# EAGLE design piezo-preamp-tickler_V3-4_single-supply-OPA164_INPROGRESS2 (EAGLE 8.5.0)

## Sheet 1 of 2
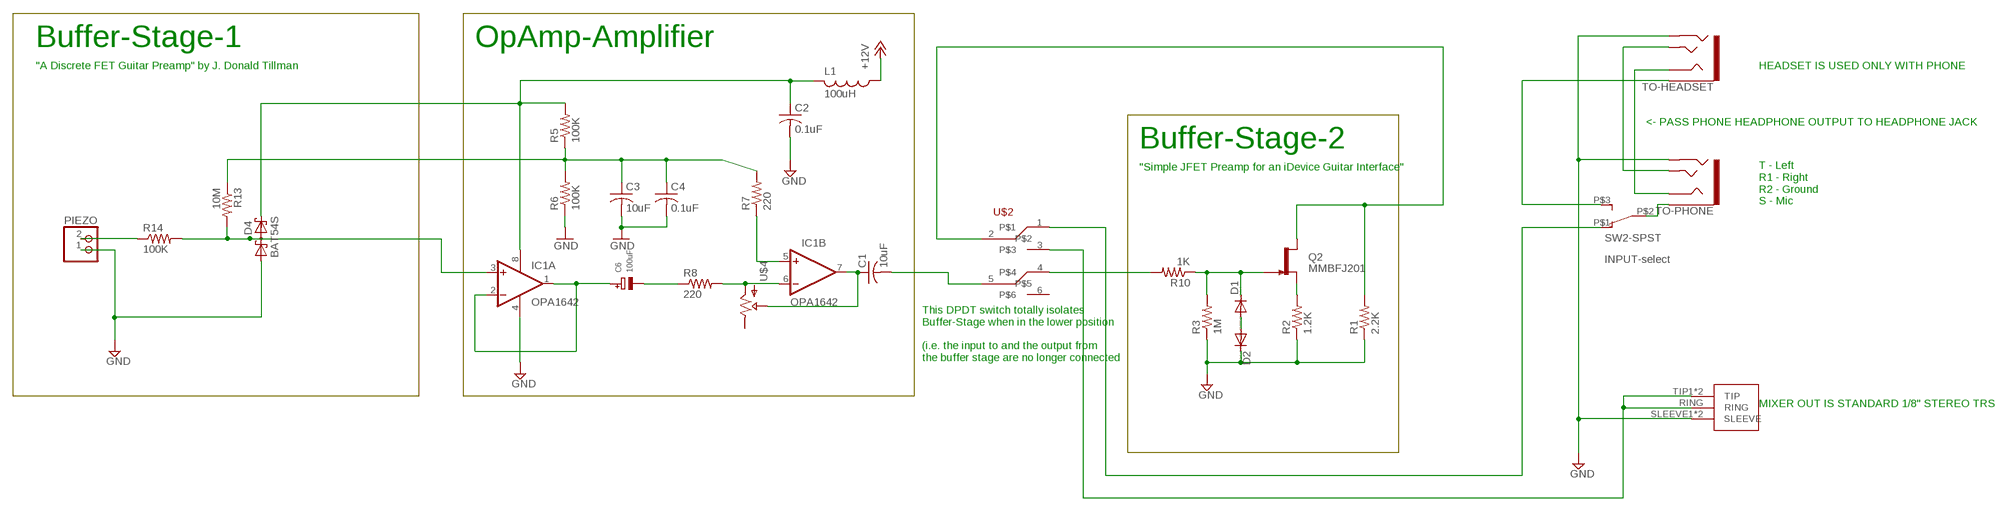
[diagram p0: schematic, sheet 1]

### Parts
C1  10uF  C-USC0603  [C0603]
C2  0.1uF  C-USC0805K  [C0805K]
C3  10uF  C-USC0805K  [C0805K]
C4  0.1uF  C-USC0805K  [C0805K]
C6  100uF  CAP_TANTALUMA/3216_REFLOW  [EIA3216-18/A-R]
D1  DIODE-SOD123  [SOD123]
D2  DIODE-SOD123  [SOD123]
D4  BAT54S  [SOT23]
IC1  OPA1642  OPA2134UA  [SO08]
J2  1/8"-F-STEREO-PCB  [1/8"-F-STEREO-PCB]
L1  100uH  L-USL3225P  [L3225P]
PIEZO  JST_2PIN-THM  [JST-PH-2-THM]
Q2  MMBFJ201  J201SOT-23  [SOT23-3]
R1  2.2K  R-US_R0603  [R0603]
R2  1.2K  R-US_R0603  [R0603]
R3  1M  R-US_R0603  [R0603]
R5  100K  R-US_R0603  [R0603]
R6  100K  R-US_R0603  [R0603]
R7  220  R-US_R0603  [R0603]
R8  220  R-US_R0603  [R0603]
R10  1K  R-US_R0603  [R0603]
R13  10M  R-US_R0603  [R0603]
R14  100K  R-US_R0603  [R0603]
SW2-SPST  INPUT-select  SWITCH_SPDTCL-SB-12B  [SWITCH_SPDT_CL-SB-12B]
TO-HEADSET  AUDIO-JACK3LGPADS  [AUDIO-JACK-TRRS-SMD]
TO-PHONE  AUDIO-JACK3LGPADS  [AUDIO-JACK-TRRS-SMD]
U$2  SWITCH_DPDT  [SWITCH_DPDT_CL-SB-22B]
U$4  POTPOT-THUMB-ALPHA  [POT-THUMB-14MM_ALPHA-RV100F-30-4K1B-B10K-B301]

### Nets
+12V: L1.1 ; also sheet 2
GND: C2.2 C3.2 C4.2 D2.C D4.1(A1) IC1.4(A:V-) J2.SLEEVE1(SLEEVE) J2.SLEEVE2(SLEEVE) PIEZO.1 R1.1 R2.1 R3.1 R6.1 TO-HEADSET.RING2 TO-PHONE.RING2 ; also sheet 2
N$1: D1.A D2.A
N$2: PIEZO.2 R14.1
N$3: Q2.2(S) R2.2
N$4: TO-HEADSET.EARTH
N$5: IC1.5(B:+IN) R7.1
N$6: C1.1 IC1.7(B:OUT) U$4.P$3(WIPER)
N$7: IC1.6(B:-IN) R8.2 U$4.P$1(IN)
N$9: D4.3(C1A2) IC1.3(A:+IN) R13.2 R14.2
N$10: D1.C Q2.3(G) R3.2 R10.1
N$11: R10.2 U$2.4
N$12: J2.RING J2.TIP1(TIP) J2.TIP2(TIP) U$2.3
N$13: TO-HEADSET.TIP TO-PHONE.TIP
N$14: C6.- R8.1
N$15: TO-HEADSET.RING1 TO-PHONE.RING1
N$16: C1.2 U$2.5
N$17: SW2-SPST.P$2 TO-PHONE.EARTH
N$19: SW2-SPST.P$1 U$2.1
N$23: C3.1 C4.1 R5.1 R6.2 R7.2 R13.1
N$24: C6.+ IC1.1(A:OUT) IC1.2(A:-IN)
N$25: C2.1 D4.2(C2) IC1.8(A:V+) L1.2 R5.2
SELECT: Q2.1(D) R1.2 U$2.2
Unconnected: SW2-SPST.P$3 U$2.6 U$4.P$2(OUT)

### Notes on the sheet
- Buffer-Stage-1 | OpAmp-Amplifier
- "A Discrete FET Guitar Preamp" by J. Donald Tillman | HEADSET IS USED ONLY WITH PHONE
- <- PASS PHONE HEADPHONE OUTPUT TO HEADPHONE JACK
- Buffer-Stage-2
- "Simple JFET Preamp for an iDevice Guitar Interface"
- T - Left
  R1 - Right
  R2 - Ground
  S - Mic
- This DPDT switch totally isolates 
  Buffer-Stage when in the lower position
  
  (i.e. the input to and the output from 
  the buffer stage are no longer connected
- MIXER OUT IS STANDARD 1/8" STEREO TRS

## Sheet 2 of 2
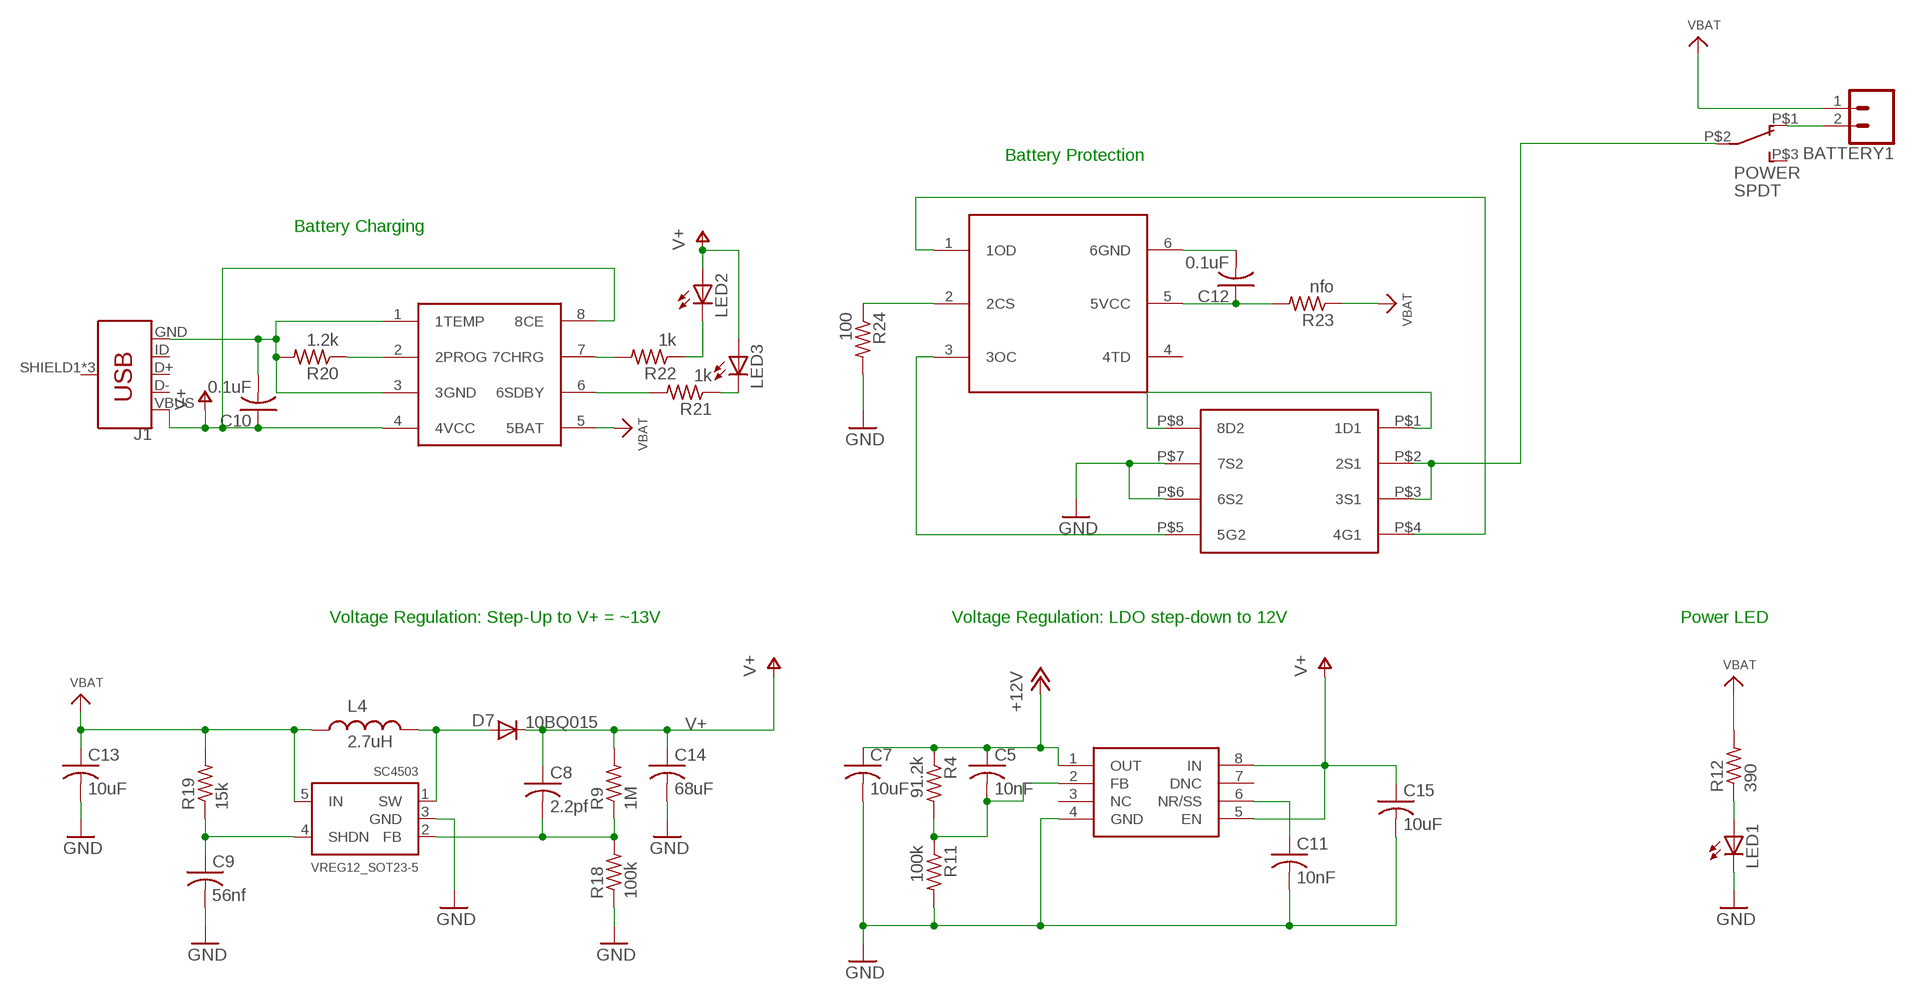
[diagram p1: schematic, sheet 2]

### Parts
BATTERY1  CONN_02LOCK  [1X02_LOCK]
C5  10nF  C-USC0603  [C0603]
C7  10uF  C-USC0603  [C0603]
C8  2.2pf  C-USC0805  [C0805]
C9  56nf  C-USC0805  [C0805]
C10  0.1uF  C-USC0805K  [C0805K]
C11  10nF  C-USC0603  [C0603]
C12  0.1uF  C-USC0805K  [C0805K]
C13  10uF  C-USC0805  [C0805]
C14  68uF  C-USC0805  [C0805]
C15  10uF  C-USC0603  [C0603]
D7  10BQ015  DIODESMA  [SMA-DIODE]
DW01A  DW01A  [SOT23-6]
F8205A  F8205A  [F8205A]
J1  USB_MICRO-BREDUCED_PASTE  [USB-B-MICRO-SMD_RED_PASTE]
L4  2.7uH  INDUCTORCR54  [CR54]
LED1  LED3MM  [LED3MM]
LED2  LED3MM  [LED3MM]
LED3  LED3MM  [LED3MM]
POWER  SPDT  SWITCH_SPDTCL-SB-12B  [SWITCH_SPDT_CL-SB-12B]
R4  91.2k  R-US_R0603  [R0603]
R9  1M  R-US_R0603  [R0603]
R11  100k  R-US_R0603  [R0603]
R12  390  R-US_R0805  [R0805]
R18  100k  R-US_R0603  [R0603]
R19  15k  R-US_R0603  [R0603]
R20  1.2k  R-US_R0603  [R0603]
R21  1k  R-US_R0603  [R0603]
R22  1k  R-US_R0603  [R0603]
R23  nfo  R-US_R0603  [R0603]
R24  100  R-US_R0603  [R0603]
SC4503  VREG12_SOT23-5  [SOT23-5]
TP4056  TP4056-CHIP  [SO08]
U$5  TPS7A49  [MSOP-8]

### Nets
+12V: C5.1 C7.1 R4.1 U$5.1(OUT) ; also sheet 1
GND: C7.2 C9.2 C11.2 C13.2 C14.2 C15.2 F8205A.P$6(6S2) F8205A.P$7(7S2) LED1.K(C) R11.2 R18.1 R24.2 SC4503.3(GND) U$5.4(GND) ; also sheet 1
N$18: LED1.A R12.1
N$20: F8205A.P$2(2S1) F8205A.P$3(3S1) POWER.P$2
N$21: BATTERY1.2 POWER.P$1
N$26: C5.2 R4.2 R11.1 U$5.2(FB)
N$28: C11.1 U$5.6(NR/SS)
N$29: C9.1 R19.1 SC4503.4(SHDN)
N$30: C8.2 R9.1 R18.2 SC4503.2(FB)
N$32: D7.A L4.P$2 SC4503.1(SW)
N$33: C10.2 J1.GND R20.2 TP4056.1(1TEMP) TP4056.3(3GND)
N$34: DW01A.1(1OD) F8205A.P$4(4G1)
N$35: R20.1 TP4056.2(2PROG)
N$36: DW01A.3(3OC) F8205A.P$5(5G2)
N$37: R22.2 TP4056.7(7CHRG)
N$38: R21.2 TP4056.6(6SDBY)
N$39: LED3.K(C) R21.1
N$40: LED2.K(C) R22.1
N$41: C12.1 DW01A.5(5VCC) R23.2
N$42: C12.2 DW01A.6(6GND)
N$43: DW01A.2(2CS) R24.1
N$44: F8205A.P$1(1D1) F8205A.P$8(8D2)
V+: C8.1 C10.1 C14.1 C15.1 D7.C J1.VBUS LED2.A LED3.A R9.2 TP4056.4(4VCC) TP4056.8(8CE) U$5.5(EN) U$5.8(IN)
VBAT: BATTERY1.1 C13.1 L4.P$1 R12.2 R19.2 R23.1 SC4503.5(IN) TP4056.5(5BAT)
Unconnected: DW01A.4(4TD) J1.D+ J1.D- J1.ID J1.SHIELD1(SHIELD) J1.SHIELD2(SHIELD) J1.SHIELD3(SHIELD) POWER.P$3 U$5.3(NC) U$5.7(DNC)

### Notes on the sheet
- Battery Protection
- Battery Charging
- Voltage Regulation: Step-Up to V+ = ~13V | Voltage Regulation: LDO step-down to 12V | Power LED

## Library data of the parts
BATTERY1 = SparkFun-Connectors:CONN_02: Multi connection point. Often used as Generic Header-pin footprint for 0.1 inch spaced/style header connections On any of the 0.1 inch spaced packages, you can populate with these: Break Away Headers - Straight <https://www.sparkfun.com/products/116> (PRT-00116) Break Away Male Headers - Right Angle <https://www.sparkfun.com/products/553> (PRT-00553) Female Headers <https://www.sparkfun.com/products/115> (PRT-00115) Break Away Headers - Machine Pin <https://www.sparkfun.com/products/117> (PRT-00117) Break Away Female Headers - Swiss Machine Pin <https://www.sparkfun.com/products/743> (PRT-00743) For SCREWTERMINALS and SPRING TERMINALS visit here: Screw Terimnals on SparkFun.com <https://www.sparkfun.com/search/results?term=Screw+Terminals> (5mm/3.5mm/2.54mm spacing) This device is also useful as a general connection point to wire up your design to another part of your project. Our various solder wires solder well into these plated through hole pads. Hook-Up Wire - Assortment (Stranded, 22 AWG) <https://www.sparkfun.com/products/11375> (PRT-11375) Hook-Up Wire - Assortment (Solid Core, 22 AWG) <https://www.sparkfun.com/products/11367> (PRT-11367) View the entire wire category on our website here <https://www.sparkfun.com/categories/141> Special notes: Molex polarized connector foot print use with: PRT-08233 with associated crimp pins and housings. 2.54_SCREWTERM for use with PRT-10571. 3.5mm Screw Terminal footprints for PRT-08084 5mm Screw Terminal footprints for use with PRT-08432
C1-C5 C7-C15 = adafruit:C-US: CAPACITOR, American symbol
C6 = microbuilder:CAP_TANTALUM: Tantalum Capacitors Wave footprints have larger pads and are meant to be used for hand soldering. Reflow footprints are optimised for solder paste and a reflow oven. EIA3216-18/A-[R/W] - Size A / 3216-18 / 1206 footprint 4.7µF 25V 10% Tantalum Capacitor 10µF 16V 10% Tantalum Capacitor [Digikey: 495-2236-2-ND] EIA3528-21/B-[R/W] - Size B / 3528-21 47µF 10V 10% Tantalum Capactior [Digikey: 495-2216-1-ND] EIA6032-28/C-[R/W] - Size C / 6032-28 10µF 35V 20% Tantalum Capacitor [Digikey: 495-2285-1-ND] 100µF 16V 10% Tantalum Capactior [Digikey: 399-5214-1-ND]
D1 D2 = diode:DIODE-: DIODE
D4 = diode:BAT54S: Schottky Diodes Pin connection corrected 2011-05-04 Source: Fairchild .. BAT54.pdf
D7 = SparkFun:DIODE: Diode These are standard reverse protection diodes and small signal diodes. SMA package can handle up to about 1A. SOD-323 can handle about 200mA. What the SOD-323 package when ordering, there are some mfgs out there that are 5-pin packages.
DW01A = CMU-ArtFab:DW01A
F8205A = CMU-ArtFab:F8205A
IC1 = linear:OPA2*: Dual Operational Amplifier Low Power, Single-Supply, Rail-To-Rail Operational Amplifier Source: http://focus.ti.com/lit/ds/symlink/opa2345.pdf http://focus.ti.com .. opa241.pdf http://focus.ti.com/lit/ds/symlink/opa2134.pdf
J1 = SparkFun-Connectors:USB_MICRO-B: USB Type Micro-B Connector Male/female and PTH/SMT variants SparkFun Products: SparkFun microB USB Breakout <https://www.sparkfun.com/products/12035> SparkFun USB microB Plug Breakout <https://www.sparkfun.com/products/10031> SparkFun ESP8266 Thing <https://www.sparkfun.com/products/13231>; PROD_ID: CONN-11752
J2 = CMU-ArtFab:1/8"-F-STEREO-PCB
L1 = rcl:L-US: INDUCTOR, American symbol; SPICEPREFIX: L
L4 = SparkFun:INDUCTOR: Inductors Basic Inductor/Choke - 0603 and 1206. Footprints are not proven and vary greatly between part numbers.
LED1-LED3 = led:LED: LED OSRAM: - CHIPLED LG R971, LG N971, LY N971, LG Q971, LY Q971, LO R971, LY R971 LH N974, LH R974 LS Q976, LO Q976, LY Q976 LO Q996 - Hyper CHIPLED LW Q18S LB Q993, LB Q99A, LB R99A - SideLED LS A670, LO A670, LY A670, LG A670, LP A670 LB A673, LV A673, LT A673, LW A673 LH A674 LY A675 LS A676, LA A676, LO A676, LY A676, LW A676 LS A679, LY A679, LG A679 - Hyper Micro SIDELED® LS Y876, LA Y876, LO Y876, LY Y876 LT Y87S - SmartLED LW L88C, LW L88S LB L89C, LB L89S, LG L890 LS L89K, LO L89K, LY L89K LS L896, LA L896, LO L896, LY L896 - TOPLED LS T670, LO T670, LY T670, LG T670, LP T670 LSG T670, LSP T670, LSY T670, LOP T670, LYG T670 LG T671, LOG T671, LSG T671 LB T673, LV T673, LT T673, LW T673 LH T674 LS T676, LA T676, LO T676, LY T676, LB T676, LH T676, LSB T676, LW T676 LB T67C, LV T67C, LT T67C, LS T67K, LO T67K, LY T67K, LW E67C LS E67B, LA E67B, LO E67B, LY E67B, LB E67C, LV E67C, LT E67C LW T67C LS T679, LY T679, LG T679 LS T770, LO T770, LY T770, LG T770, LP T770 LB T773, LV T773, LT T773, LW T773 LH T774 LS E675, LA E675, LY E675, LS T675 LS T776, LA T776, LO T776, LY T776, LB T776 LHGB T686 LT T68C, LB T68C - Hyper Mini TOPLED® LB M676 - Mini TOPLED Santana® LG M470 LS M47K, LO M47K, LY M47K Source: http://www.osram.convergy.de LUXEON: - LUMILED® LXK2-PW12-R00, LXK2-PW12-S00, LXK2-PW14-U00, LXK2-PW14-V00 LXK2-PM12-R00, LXK2-PM12-S00, LXK2-PM14-U00 LXK2-PE12-Q00, LXK2-PE12-R00, LXK2-PE12-S00, LXK2-PE14-T00, LXK2-PE14-U00 LXK2-PB12-K00, LXK2-PB12-L00, LXK2-PB12-M00, LXK2-PB14-N00, LXK2-PB14-P00, LXK2-PB14-Q00 LXK2-PR12-L00, LXK2-PR12-M00, LXK2-PR14-Q00, LXK2-PR14-R00 LXK2-PD12-Q00, LXK2-PD12-R00, LXK2-PD12-S00 LXK2-PH12-R00, LXK2-PH12-S00 LXK2-PL12-P00, LXK2-PL12-Q00, LXK2-PL12-R00 Source: www.luxeon.com KINGBRIGHT: KA-3528ASYC Source: www.kingbright.com
PIEZO = adafruit:JST_2PIN: JST 2-Pin Connectors of various flavors SMT-RA (S2B-PH-SM4) 4UConnector #17311 SMT (B2B-PH-SM4) THM-RA (S2B-PH) THM (B2B-PH)
POWER SW2-SPST = CMU-ArtFab:SWITCH_SPDT
Q2 = CMU-ArtFab:J201: N-channel JFET
R1-R14 R18-R24 = CMU-ArtFab:R-US_: RESISTOR, American symbol
SC4503 = CMU-ArtFab:VREG12_SOT23-5: SOT23-5 Fixed Voltage Regulators To better organise some of the SOT23-5 fixed voltage regulators in this library, this new part was created. Part Current Out V Out V In V Dropout Digikey Part No. ADP121 150mA 3.3V 3.4-5.5V 0.09V @ 150mA ADP121-AUJZ33R7CT-ND ADP121 150mA 3.0V 3.1-5.5V 0.09V @ 150mA ADP121-AUJZ30R7CT-ND ADP122 300mA 3.3V 3.4-5.5V 0.085V @ 300mA ADP122AUJZ-3.3-R7CT-ND ADP1712 300mA 3.3V 3.5-5.5V 0.17V @ 300mA ADP1712AUJZ-3.3-R7TR-ND AP7311 (Low Cost) 150mA 3.3V 3.5-6V 0.15V @ 150mA AP7311-33WG-7DICT-ND LD39015M18R 150mA 1.8V 1.9V-5.5V 0.08V @ 100mA 497-6977-1-ND MCP1824T-3302E/OT 300mA 3.3V 3.5V-6V 0.2V @ 300mA MCP1824T-3302E/OTCT-ND MIC5205-2.5YM5 TR 150mA 2.5V 2.7-16V 0.165V @ 150mA 576-1257-2-ND MIC5205-3.0YM5 TR 150mA 3.0V 3.2V-16V 0.165V @ 150mA 576-1258-2-ND MIC5205-3.3YM5 TR 150mA 3.3V 3.5V-16V 0.165V @ 150mA 576-1259-2-ND TPS780330220 150mA 3.3V+2.2V 3.6-5.5V 250mV Max 296-23332-1-ND TDA3663/N1,135 100mA 3.3V 3.5-45V 0.18V @ 50mA 568-5343-1-ND
TO-HEADSET TO-PHONE = Daniel:AUDIO-JACK3: Audio jack - 3.5mm TRRS variety - two rings.
TP4056 = CMU-ArtFab:TP4056-CHIP
U$2 = CMU-ArtFab:SWITCH_DPDT
U$4 = CMU-ArtFab:POT: http://www.taydaelectronics.com/10k-ohm-linear-taper-potentiometer-round-shaft-pcb-9mm.html http://www.taydaelectronics.com/datasheets/A-1847.pdf
U$5 = CMU-ArtFab:TPS7A49

## Board
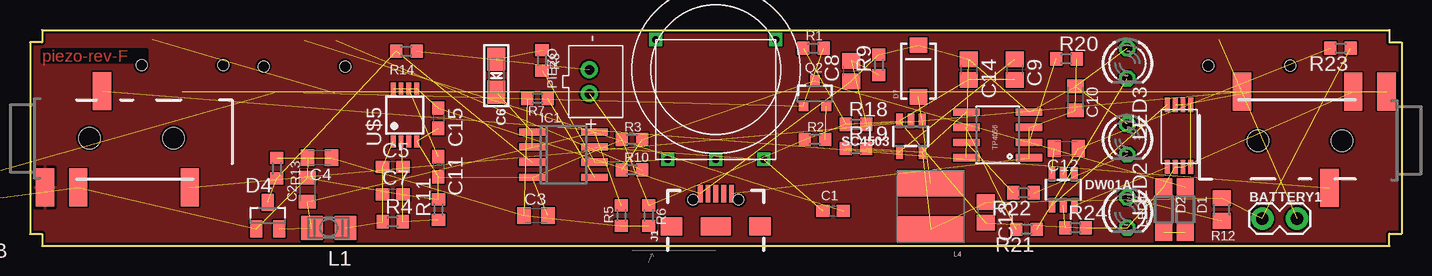
[diagram p2: board, top side]
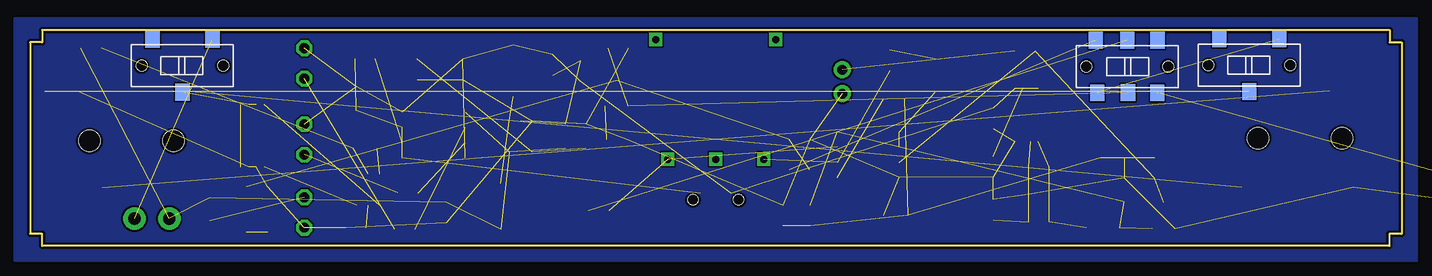
[diagram p3: board, bottom side, seen from below]

Size 114.3 x 18.03 mm. Coordinates in mm from the lower left corner, seen from the top.
Outline: 0,17 0,1 1.02,1 1.02,0 113.28,0 113.28,1.02 114.3,1.02 114.3,17 113.28,17 113.28,18.03 1,18.03 1,17 0,17
Copper layers (1*16): Top 0.035mm / dielectric 1.5mm / Bottom 0.035mm
Design rules "default *": minimum track width 6mil, minimum drill 0.35mm, track to track 6mil, track to pad 6mil, pad to pad 6mil, via to via 6mil, smd to smd 6mil, copper to edge 8mil, drill to drill 6mil, minimum pad ring 10mil, minimum via ring 8mil, stop-mask expansion 4mil, vias tented up to drill 20mil, thermal gap 10mil

### Footprints (pad centres in the part's own frame; a part is rotated, then mirrored left to right if it is on the bottom)
1X02_LOCK = drill 1.016 pad 1.88: 1 -0.178,0; 2 2.718,0
C0603 = smd 1.1 x 1: 1 -0.85,0; 2 0.85,0
C0805K = smd 1.1 x 1.4: 1 -1,0; 2 1,0
EIA3216-18/A-R = smd 1.95 x 1.5: + 1.375,0; - -1.375,0
C0805 = smd 1.3 x 1.5: 1 -0.85,0; 2 0.85,0
SOD123 = smd 1.4 x 1.4: A 1.9,0; C -1.9,0
SOT23 = smd 1 x 1.4: 1 -0.95,-1.1; 2 0.95,-1.1; 3 0,1.1
SMA-DIODE = smd 1.27 x 1.47: A -2.15,0; C 2.15,0
SOT23-6 = smd 0.55 x 1.2: 1 -0.95,-1.3; 2 0,-1.3; 3 0.95,-1.3; 4 0.95,1.3; 5 0,1.303; 6 -0.95,1.3
F8205A = smd 0.406 x 1.2: P$1 -0.975,-2.65; P$2 -0.325,-2.65; P$3 0.325,-2.65; P$4 0.975,-2.65; P$5 0.975,2.55; P$6 0.325,2.55; P$7 -0.325,2.55; P$8 -0.975,2.55
SO08 = smd 0.6 x 2.2: 1 -1.905,-2.6; 2 -0.635,-2.6; 3 0.635,-2.6; 4 1.905,-2.6; 5 1.905,2.6; 6 0.635,2.6; 7 -0.635,2.6; 8 -1.905,2.6
USB-B-MICRO-SMD_RED_PASTE = smd 1.45 x 0.4: D+ 2.725,0; D- 2.725,0.65; GND 2.725,-1.3; ID 2.725,-0.65; VBUS 2.725,1.3 | smd 1.5 x 1.8: SHIELD1 0,3.685; SHIELD2 0,-3.685 | smd 1.5 x 2.5: SHIELD3 0,0 | hole 0.85: 2.2,1.9; 2.2,-1.9
1/8"-F-STEREO-PCB = drill 1.3: RING 5.461,0; SLEEVE1 8.636,6.934; SLEEVE2 8.636,0; TIP1 2.286,6.934; TIP2 2.286,0 | hole 1.4: 2.286,3.556; 7.874,3.556
L3225P = smd 1.8 x 2: 1 -1.4,0; 2 1.4,0
CR54 = smd 5.5 x 2.15: P$1 0,1.92; P$2 0,-1.92
LED3MM = drill 0.813 octagon: A -1.27,0; K 1.27,0
JST-PH-2-THM = drill 0.8 pad 1.422: 1 1,0; 2 -1,0
SWITCH_SPDT_CL-SB-12B = smd 1.2 x 1.4: P$1 -2.5,-2.2; P$2 0,2.2; P$3 2.5,-2.2 | hole 0.9: -3.4,0; 3.4,0
SOT23-3 = smd 0.8 x 0.9: 1 -0.95,-1; 2 0.95,-1; 3 0,1.1
R0603 = smd 1 x 1.1: 1 -0.85,0; 2 0.85,0
R0805 = smd 1.3 x 1.5: 1 -0.95,0; 2 0.95,0
SOT23-5 = smd 0.55 x 1.2: 1 -0.95,-1.3; 2 0,-1.3; 3 0.95,-1.3; 4 0.95,1.3; 5 -0.95,1.3
AUDIO-JACK-TRRS-SMD = smd 1.524 x 3.175: EARTH -2.114,-5.271; RING1 2.644,2.759; RING2 0.66,-5.271; TIP 9.948,-5.271 | hole 1.778: 1.6,-1.15; 8.6,-1.15
SO08' = smd 0.61 x 2.21: 1 -1.905,-2.616; 2 -0.635,-2.616; 3 0.635,-2.616; 4 1.905,-2.616; 5 1.905,2.616; 6 0.635,2.616; 7 -0.635,2.616; 8 -1.905,2.616
SWITCH_DPDT_CL-SB-22B = smd 1.2 x 1.4: 1 -2.5,-2.2; 2 0.05,-2.17; 3 2.5,-2.2; 4 -2.63,2.2; 5 0,2.2; 6 2.51,2.2 | hole 0.9: -3.4,0; 3.4,0
POT-THUMB-14MM_ALPHA-RV100F-30-4K1B-B10K-B301 = drill 0.6 square: P$1 -4,-7.5; P$2 0,-7.5; P$3 4,-7.5; P$4 -5,2.5; P$5 5,2.5
MSOP-8 = smd 0.4 x 1: 1 -0.975,-2.2; 2 -0.325,-2.2; 3 0.325,-2.2; 4 0.975,-2.2; 5 0.975,2.2; 6 0.325,2.2; 7 -0.325,2.2; 8 -0.975,2.2

### Placement (x,y rotation side)
BATTERY1  102.87,2.29 0 top
C1  66.93,2.92 0 top
C2  23.11,4.7 90 top
C3  42.16,2.54 0 top
C4  24.13,7.37 180 top
C5  30.23,6.6 0 top
C6  38.86,14.22 270 top
C7  30.23,4.32 0 top
C8  68.45,14.61 90 top
C9  82.04,14.73 270 top
C10  87.12,12.32 270 top
C11  34.04,6.6 270 top
C12  86.36,8.13 180 top
C13  79.63,2.79 270 top
C14  78.23,14.73 270 top
C15  34.04,10.67 270 top
D1  96.27,3.05 270 top
D2  94.49,3.05 270 top
D4  19.81,2.54 0 top
D7  74.04,14.61 90 top
DW01A  86.11,4.7 0 top
F8205A  95.76,9.14 180 top
IC1  44.45,7.62 270 top
J1  57.15,1.65 90 top
J2  -20.32,2.79 0 top  (outside the outline)
L1  24.89,1.52 180 top
L4  75.06,3.3 180 top
LED1  91.44,2.79 270 top
LED2  91.44,8.89 270 top
LED3  91.44,15.24 270 top
PIEZO  46.61,13.72 270 top
POWER  101.6,15.04 180 bottom
Q2  65.41,12.7 0 top
R1  65.28,16.51 0 top
R2  65.41,8.89 0 top
R3  50.16,8.89 0 top
R4  30.23,2.03 0 top
R5  49.28,2.54 90 top
R6  51.56,2.54 270 top
R7  42.29,12.32 180 top
R8  42.67,15.49 270 top
R9  70.74,15.11 90 top
R10  50.16,6.35 0 top
R11  34.04,3.05 90 top
R12  99.31,3.05 90 top
R13  20.57,6.48 270 top
R14  31.37,16.26 180 top
R18  68.83,10.16 0 top
R19  68.83,8.13 0 top
R20  86.36,15.62 0 top
R21  83.06,1.4 180 top
R22  82.8,4.45 180 top
R23  109.22,16.51 180 top
R24  87.12,1.52 0 top
SC4503  73.41,9.14 180 top
SW2-SPST  12.7,15.08 180 bottom
TO-HEADSET  3.37,10.16 0 top
TO-PHONE  110.94,7.62 180 top
TP4056  TP4056-CHIP  [SO08']  80.64,9.27 90 top
U$2  22.86,14.99 0 bottom
U$4  57.15,14.73 0 top
U$5  31.24,10.92 0 top

### Tracks (layer width: path | path; a pad name or v marks a point on that pad's centre or on a via)
+12V  (4 unrouted)
GND  (28 unrouted)
N$1  (1 unrouted)
N$2  (1 unrouted)
N$3  (1 unrouted)
N$4
  pour Top: -1.27,19.05 -1.27,-1.27 115.57,-1.27 115.57,19.05
N$5  (1 unrouted)
N$6  (2 unrouted)
N$7  (2 unrouted)
N$8
  pour Bottom: -1.27,19.05 -1.27,-1.27 115.57,-1.27 115.57,19.05
N$9  (3 unrouted)
N$10  (3 unrouted)
N$11  (1 unrouted)
N$12  (3 unrouted)
N$13  (1 unrouted)
N$14  (1 unrouted)
N$15  (1 unrouted)
N$16  (1 unrouted)
N$17  (1 unrouted)
N$18  (1 unrouted)
N$19  (1 unrouted)
N$20  (2 unrouted)
N$21  (1 unrouted)
N$23  (5 unrouted)
N$24  (2 unrouted)
N$25  (4 unrouted)
N$26  (3 unrouted)
N$28  (1 unrouted)
N$29  (2 unrouted)
N$30  (3 unrouted)
N$32  (2 unrouted)
N$33  (4 unrouted)
N$34  (1 unrouted)
N$35  (1 unrouted)
N$36  (1 unrouted)
N$37  (1 unrouted)
N$38  (1 unrouted)
N$39  (1 unrouted)
N$40  (1 unrouted)
N$41  (2 unrouted)
N$42  (1 unrouted)
N$43  (1 unrouted)
N$44  (1 unrouted)
SELECT  (2 unrouted)
V+  (12 unrouted)
VBAT  (7 unrouted)

### Text on the board
Top: piezo-rev-F